# EAGLE design bt lokomotivy v1 (EAGLE 6.3)
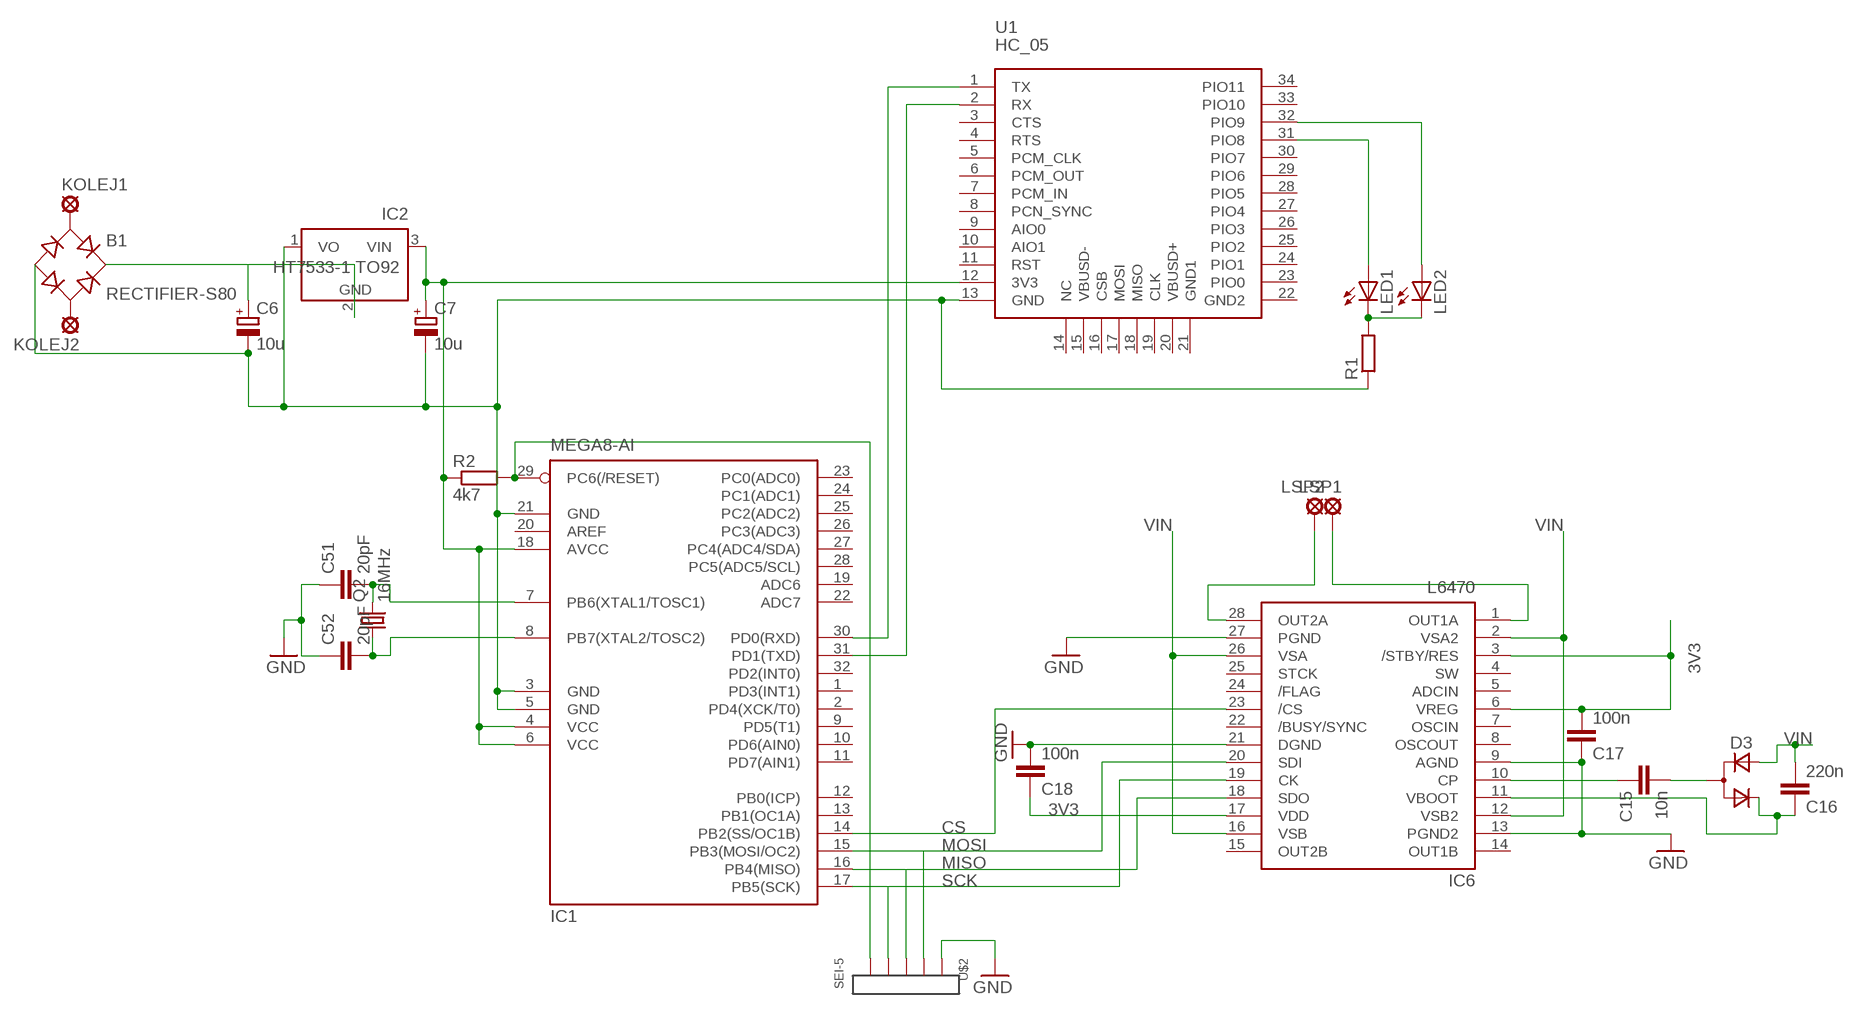
[diagram p0: schematic, sheet 1]

## Parts
B1  RECTIFIER-S80  [TO-269AA]
C6  10u  CPOL-EU153CLV-0405  [153CLV-0405]
C7  10u  CPOL-EU153CLV-0405  [153CLV-0405]
C15  10n  C-EUC0603  [C0603]
C16  220n  C-EUC0603K  [C0603K]
C17  100n  C-EUC0402  [C0402]
C18  100n  C-EUC0402  [C0402]
C51  20pF  C-EUC0603  [C0603]
C52  20pF  C-EUC0603  [C0603]
D3  D_ACACSOT323  [SOT323]
IC1  MEGA8-AI  [TQFP32-08]
IC2  HT7533-1 TO92  LM2936Z-3.0  [TO92]
IC6  L6470  [HTSSOP28]
KOLEJ1  LSP10  [LSP10]
KOLEJ2  LSP10  [LSP10]
LED1  LEDCHIPLED_0603  [CHIPLED_0603]
LED2  LEDCHIPLED_0603  [CHIPLED_0603]
LSP1  LSP10  [LSP10]
LSP2  LSP10  [LSP10]
Q2  16MHz  CRYSTALHC49UP  [HC49UP]
R1  R-EU_R0603  [R0603]
R2  4k7  R-EU_R0603  [R0603]
U1  HC_05  [BLUETOOTH_SMD]
U$2  SEI-5  [SEI-5]

## Nets
3V3: C7.+ C17.2 C18.1 IC1.4(VCC) IC1.6(VCC) IC1.18(AVCC) IC2.3(VIN) IC6.3(/STBY/RES) IC6.6(VREG) IC6.17(VDD) R2.1 U1.12(3V3)
CS: IC1.14(PB2(SS/OC1B)) IC6.23(/CS)
GND [Power]: B1.- C6.- C7.- C17.1 C18.2 C51.1 C52.1 IC1.3(GND) IC1.5(GND) IC1.21(GND) IC2.1(VO) IC6.9(AGND) IC6.13(PGND2) IC6.21(DGND) IC6.27(PGND) R1.1 U1.13(GND) U$2.P$1
MISO: IC1.16(PB4(MISO)) IC6.18(SDO) U$2.P$3
MOSI: IC1.15(PB3(MOSI/OC2)) IC6.20(SDI) U$2.P$2
N$1: IC1.30(PD0(RXD)) U1.1(TX)
N$2: LED1.C LED2.C R1.2
N$3: B1.AC1 KOLEJ1.MP
N$4: B1.AC2 KOLEJ2.MP
N$5: IC1.31(PD1(TXD)) U1.2(RX)
N$8: IC1.29(PC6(/RESET)) R2.2 U$2.P$5
N$9: C51.2 IC1.7(PB6(XTAL1/TOSC1)) Q2.2
N$10: C52.2 IC1.8(PB7(XTAL2/TOSC2)) Q2.1
N$12: LED1.A U1.31(PIO8)
N$14: LED2.A U1.32(PIO9)
N$28: C15.1 IC6.10(CP)
N$29: C15.2 D3.1(CA)
SCK: IC1.17(PB5(SCK)) IC6.19(CK) U$2.P$4
VBOOTX: C16.1 D3.2(C) IC6.11(VBOOT)
VIN: B1.+ C6.+ C16.2 D3.3(A) IC2.2(GND) IC6.2(VSA2) IC6.12(VSB2) IC6.16(VSB) IC6.26(VSA)
X1: IC6.1(OUT1A) LSP1.MP
X2: IC6.28(OUT2A) LSP2.MP
Unconnected: IC1.1(PD3(INT1)) IC1.2(PD4(XCK/T0)) IC1.9(PD5(T1)) IC1.10(PD6(AIN0)) IC1.11(PD7(AIN1)) IC1.12(PB0(ICP)) IC1.13(PB1(OC1A)) IC1.19(ADC6) IC1.20(AREF) IC1.22(ADC7) IC1.23(PC0(ADC0)) IC1.24(PC1(ADC1)) IC1.25(PC2(ADC2)) IC1.26(PC3(ADC3)) IC1.27(PC4(ADC4/SDA)) IC1.28(PC5(ADC5/SCL)) IC1.32(PD2(INT0)) IC6.4(SW) IC6.5(ADCIN) IC6.7(OSCIN) IC6.8(OSCOUT) IC6.14(OUT1B) IC6.15(OUT2B) IC6.22(/BUSY/SYNC) IC6.24(/FLAG) IC6.25(STCK) U1.3(CTS) U1.4(RTS) U1.5(PCM_CLK) U1.6(PCM_OUT) U1.7(PCM_IN) U1.8(PCN_SYNC) U1.9(AIO0) U1.10(AIO1) U1.11(RST) U1.14(NC) U1.15(VBUSD-) U1.16(CSB) U1.17(MOSI) U1.18(MISO) U1.19(CLK) U1.20(VBUSD+) U1.21(GND1) U1.22(GND2) U1.23(PIO0) U1.24(PIO1) U1.25(PIO2) U1.26(PIO3) U1.27(PIO4) U1.28(PIO5) U1.29(PIO6) U1.30(PIO7) U1.33(PIO10) U1.34(PIO11)

## Library data of the parts
B1 = rectifier:RECTIFIER-: Rectifier
C6 C7 = rcl:CPOL-EU: POLARIZED CAPACITOR, European symbol
C15-C18 = resistor:C-EU: CAPACITOR, European symbol
C51 C52 = rcl:C-EU: CAPACITOR, European symbol
D3 = zetex:D_ACAC: Dual DIODE; OC_FARNELL: unknown; OC_NEWARK: unknown
IC1 = atmel:MEGA8: MICROCONTROLLER 8 Kbytes FLASH, 1 kbytes SRAM, 512 bytes EEPROM, USART, 6-channel 10 bit ADC, 2-channel 8 bit ADC Pin compatible with Atmega48, ATMega88, ATMega168 Source: avr.lbr; MPN: ATMEGA8-16AU; OC_FARNELL: 9171371; OC_NEWARK: 73M8863
IC2 = national-semiconductor:LM2936?*: Ultra-Low Quiescent Current LDO Voltage Regulator Source: Data sheet <http://www.national.com/ds/LM/LM2936.pdf>; MF: NATIONAL SEMICONDUCTOR; MPN: LM2936Z-3.0/NOPB; OC_FARNELL: 1312709; OC_NEWARK: 41K4531
IC6 = reprap:L6470: Fully integrated microstepping motor driver with motion engine and SPI
KOLEJ1 KOLEJ2 LSP1 LSP2 = solpad:LSP10: SOLDER PAD drill 1.0 mm, distributor Buerklin, 12H555
LED1 LED2 = led:LED: LED OSRAM: - CHIPLED LG R971, LG N971, LY N971, LG Q971, LY Q971, LO R971, LY R971 LH N974, LH R974 LS Q976, LO Q976, LY Q976 LO Q996 - Hyper CHIPLED LW Q18S LB Q993, LB Q99A, LB R99A - SideLED LS A670, LO A670, LY A670, LG A670, LP A670 LB A673, LV A673, LT A673, LW A673 LH A674 LY A675 LS A676, LA A676, LO A676, LY A676, LW A676 LS A679, LY A679, LG A679 - Hyper Micro SIDELED® LS Y876, LA Y876, LO Y876, LY Y876 LT Y87S - SmartLED LW L88C, LW L88S LB L89C, LB L89S, LG L890 LS L89K, LO L89K, LY L89K LS L896, LA L896, LO L896, LY L896 - TOPLED LS T670, LO T670, LY T670, LG T670, LP T670 LSG T670, LSP T670, LSY T670, LOP T670, LYG T670 LG T671, LOG T671, LSG T671 LB T673, LV T673, LT T673, LW T673 LH T674 LS T676, LA T676, LO T676, LY T676, LB T676, LH T676, LSB T676, LW T676 LB T67C, LV T67C, LT T67C, LS T67K, LO T67K, LY T67K, LW E67C LS E67B, LA E67B, LO E67B, LY E67B, LB E67C, LV E67C, LT E67C LW T67C LS T679, LY T679, LG T679 LS T770, LO T770, LY T770, LG T770, LP T770 LB T773, LV T773, LT T773, LW T773 LH T774 LS E675, LA E675, LY E675, LS T675 LS T776, LA T776, LO T776, LY T776, LB T776 LHGB T686 LT T68C, LB T68C - Hyper Mini TOPLED® LB M676 - Mini TOPLED Santana® LG M470 LS M47K, LO M47K, LY M47K Source: http://www.osram.convergy.de LUXEON: - LUMILED® LXK2-PW12-R00, LXK2-PW12-S00, LXK2-PW14-U00, LXK2-PW14-V00 LXK2-PM12-R00, LXK2-PM12-S00, LXK2-PM14-U00 LXK2-PE12-Q00, LXK2-PE12-R00, LXK2-PE12-S00, LXK2-PE14-T00, LXK2-PE14-U00 LXK2-PB12-K00, LXK2-PB12-L00, LXK2-PB12-M00, LXK2-PB14-N00, LXK2-PB14-P00, LXK2-PB14-Q00 LXK2-PR12-L00, LXK2-PR12-M00, LXK2-PR14-Q00, LXK2-PR14-R00 LXK2-PD12-Q00, LXK2-PD12-R00, LXK2-PD12-S00 LXK2-PH12-R00, LXK2-PH12-S00 LXK2-PL12-P00, LXK2-PL12-Q00, LXK2-PL12-R00 Source: www.luxeon.com KINGBRIGHT: KA-3528ASYC Source: www.kingbright.com
Q2 = crystal:CRYSTAL: CRYSTAL; OC_FARNELL: unknown; OC_NEWARK: unknown
R1 R2 = rcl:R-EU_: RESISTOR, European symbol
U1 = SerialPortBluetooth:HC_05
U$2 = con-samtec:SEI-5

## Net classes
0 default: width 0.15 mm, clearance 0.15 mm
1 Power: width 0.25 mm, drill 0.381 mm, clearance 0.15 mm

## Board
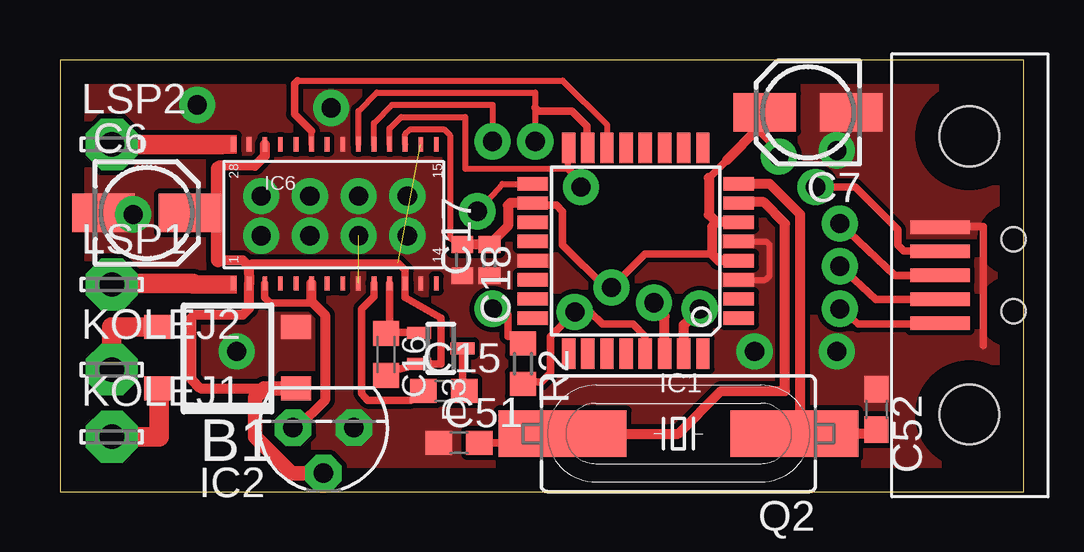
[diagram p1: board, top side]
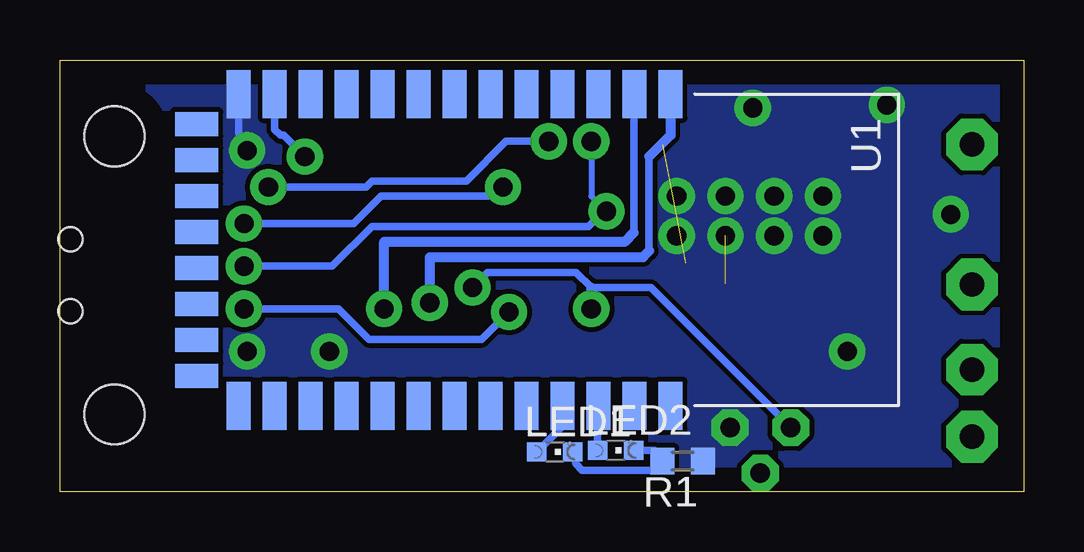
[diagram p2: board, bottom side, seen from below]

Size 40.18 x 18 mm. Coordinates in mm from the lower left corner, seen from the top.
Outline: 0,0 40.18,0 40.18,18 0,18 0,0
Copper layers (1*16): Top 0.035mm / dielectric 1.5mm / Bottom 0.035mm
Design rules "default *": minimum track width 10mil, minimum drill 24mil, track to track 8mil, track to pad 8mil, pad to pad 8mil, via to via 8mil, smd to smd 8mil, copper to edge 1mm, drill to drill 8mil, minimum pad ring 14mil, minimum via ring 14mil, stop-mask expansion 4mil, vias tented up to drill 0mil, thermal gap 10mil

### Footprints (pad centres in the part's own frame; a part is rotated, then mirrored left to right if it is on the bottom)
TO-269AA = smd 1 x 1.25: + -1.28,-2.855; - 1.28,-2.855; AC1 -1.28,2.855; AC2 1.28,2.855
153CLV-0405 = smd 2.6 x 1.6: + 1.8,0; - -1.8,0
C0603 = smd 1.1 x 1: 1 -0.85,0; 2 0.85,0
C0603K = smd 1.05 x 1.08: 1 -0.875,0; 2 0.875,0
C0402 = smd 0.7 x 0.9: 1 -0.65,0; 2 0.65,0
SOT323 = smd 0.5 x 1: 1 0,0.9; 2 -0.65,-0.9; 3 0.65,-0.9
TQFP32-08 = smd 1.27 x 0.559: 1 -4.293,2.8; 2 -4.293,2; 3 -4.293,1.2; 4 -4.293,0.4; 5 -4.293,-0.4; 6 -4.293,-1.2; 7 -4.293,-2; 8 -4.293,-2.8; 17 4.293,-2.8; 18 4.293,-2; 19 4.293,-1.2; 20 4.293,-0.4; 21 4.293,0.4; 22 4.293,1.2; 23 4.293,2; 24 4.293,2.8 | smd 0.559 x 1.27: 9 -2.8,-4.293; 10 -2,-4.293; 11 -1.2,-4.293; 12 -0.4,-4.293; 13 0.4,-4.293; 14 1.2,-4.293; 15 2,-4.293; 16 2.8,-4.293; 25 2.8,4.293; 26 2,4.293; 27 1.2,4.293; 28 0.4,4.293; 29 -0.4,4.293; 30 -1.2,4.293; 31 -2,4.293; 32 -2.8,4.293
TO92 = drill 0.813 pad 1.27 octagon: 1 -1.27,0; 2 0,1.905; 3 1.27,0
HTSSOP28 = smd 0.2 x 0.6: 1 -4.445,-3.26; 2 -3.795,-3.26; 3 -3.145,-3.26; 4 -2.495,-3.26; 5 -1.845,-3.26; 6 -1.195,-3.26; 7 -0.545,-3.26; 8 0.105,-3.26; 9 0.755,-3.26; 10 1.405,-3.26; 11 2.055,-3.26; 12 2.705,-3.26; 13 3.355,-3.26; 14 4.005,-3.26; 15 4.005,2.54; 16 3.355,2.54; 17 2.705,2.54; 18 2.055,2.54; 19 1.405,2.54; 20 0.755,2.54; 21 0.105,2.54; 22 -0.545,2.54; 23 -1.195,2.54; 24 -1.845,2.54; 25 -2.495,2.54; 26 -3.145,2.54; 27 -3.795,2.54; 28 -4.445,2.54
LSP10 = drill 1.016 pad 2.159 octagon: MP 0,0
CHIPLED_0603 = smd 0.8 x 0.8: A 0,-0.75; C 0,0.75
HC49UP = smd 5.334 x 1.93: 1 -4.826,0; 2 4.826,0
R0603 = smd 1 x 1.1: 1 -0.85,0; 2 0.85,0
BLUETOOTH_SMD = smd 2 x 1: 1 0,0; 2 0,-1.5; 3 0,-3; 4 0,-4.5; 5 0,-6; 6 0,-7.5; 7 0,-9; 8 0,-10.5; 9 0,-12; 10 0,-13.5; 11 0,-15; 12 0,-16.5; 13 0,-18; 22 13,-18; 23 13,-16.5; 24 13,-15; 25 13,-13.5; 26 13,-12; 27 13,-10.5; 28 13,-9; 29 13,-7.5; 30 13,-6; 31 13,-4.5; 32 13,-3; 33 13,-1.5; 34 13,0 | smd 1 x 1.8: 14 1.25,-19.75; 15 2.75,-19.75; 16 4.25,-19.75; 17 5.75,-19.75; 18 7.25,-19.75; 19 8.75,-19.75; 20 10.25,-19.75; 21 11.75,-19.75
SEI-5 = smd 0.56 x 2.477: P$1 -2,-1.04; P$2 -1,-1.04; P$3 0,-1.04; P$4 1,-1.04; P$5 2,-1.04 | hole 2.5: -5.8,0.187; 5.8,0.187 | hole 1: -1.5,2.03; 1.5,2.03

### Placement (x,y rotation side)
B1  6.99,5.59 90 top
C6  3.62,11.62 0 top
C7  31.18,15.81 180 top
C15  16,4.19 0 top
C16  13.59,5.71 270 top
C17  17.91,9.65 90 top
C18  16.76,9.65 270 top
C51  16.64,2.03 0 top
C52  34.04,3.43 270 top
D3  15.88,5.97 270 top
IC1  24,10.03 180 top
IC2  10.99,2.67 180 top
IC6  11.68,11.94 0 top
KOLEJ1  2.16,2.29 0 top
KOLEJ2  2.16,5.08 0 top
LED1  19.56,1.65 270 bottom
LED2  17.02,1.71 270 bottom
LSP1  2.16,8.64 0 top
LSP2  2.16,14.48 0 top
Q2  25.78,2.41 180 top
R1  14.22,1.27 180 bottom
R2  19.3,5.33 270 top
U1  14.73,16.57 270 bottom
U$2  37.72,9.02 270 top

### Tracks (layer width: path | path; a pad name or v marks a point on that pad's centre or on a via)
3V3  (via drill 0.8)
  Top 0.254: IC6.17 14.39,14.9 14.61,15.11 16,15.11 16.26,14.86 16.26,10.56 C18.1
  Top 0.305: IC6.3 8.54,8.1 8.76,7.87 10.44,7.87 10.49,7.93 | 27.81,13.84 27.05,13.08 | 27.18,9.91 24.38,9.91 v22.99,8.51 22.73,8.51 20.95,10.29 20.95,11.68 20.7,11.94 19.8,11.94 IC1.18 | C7.+ 29.4,15.81 29.46,15.75 | v29.97,13.97 29.97,14.22 29.08,15.11 | v18.03,7.62 18.67,7.37 18.67,6.48 19.01,6.48 R2.1
  Top 0.406: IC6.6 10.49,7.93 11.05,7.37 11.05,3.81 9.91,2.67 IC2.3 | IC1.18 18.76,12.03 18.67,11.94 18.67,11.06 C17.2 C18.1 | IC1.4 27.45,9.63 27.18,9.91 27.18,11.05 27.36,11.23 | IC1.6 27.36,11.23 | C7.+ 29.38,15.41 29.08,15.11 27.81,13.84 | 27.05,13.08 27.05,11.54 27.36,11.23
  Top 0.61: IC2.3 10.16,2.67
  Bottom 0.305: IC2.3 15.56,8.51 18.03,8.51 18.67,9.14 22.35,9.14 v22.99,8.51 | U1.12 31.23,15.1 30.99,14.86 30.86,14.86 v29.97,13.97
  Bottom 0.406: v18.03,7.62 18.03,8.51
CS
  Top 0.254: IC6.23 10.49,15.04 | 9.91,17.14 20.95,17.14 22.8,15.3 IC1.14
  Top 0.305: 9.91,17.14 9.78,17.02 9.78,15.75 10.49,15.04
GND  (via drill 0.8)  (1 unrouted)
  Top 0.254: IC1.3 29.41,8.83 29.59,9.02 29.59,10.29 29.46,10.41 28.32,10.41 IC1.5
  Top 0.305: 37.85,11.05 38.48,11.05 38.48,6.1 | v32.38,14.22 32.38,15.22 C7.-
  Bottom 0.305: U1.13 32.73,14.95 v32.38,14.22
  other vias: 7.37,5.84 8.38,12.32 8.38,10.67 10.41,10.67 10.41,12.32 12.45,12.32 12.45,10.67 14.48,10.67 14.48,12.32 5.71,16.13 11.3,16 3.05,11.56 28.96,5.84 32.38,5.84
  pour Top (no thermals): 0,18.03 41.02,18.16 41.02,0.13 0,0
  pour Bottom (no thermals): 0,0 0,18.03 41.02,18.16 41.02,0.13
MISO  (via drill 0.8)
  Top 0.254: IC6.18 13.74,15.14 14.22,15.62 16.89,15.62 16.89,13.46 21.18,13.46 IC1.16
  Top 0.305: v21.72,12.7 21.72,12.92 21.18,13.46 | U$2.P$3 34.8,9.02 v32.51,11.18
  Bottom 0.305: v32.51,11.18 27.94,11.18 26.8,12.32 21.97,12.32 v21.72,12.7
MOSI  (via drill 0.8)
  Top 0.254: IC6.20 12.44,15.87 13.21,16.64 19.81,16.64 19.81,16 v19.81,14.61 | 21.97,14.36 IC1.15 | 36.66,10.03 U$2.P$2
  Top 0.305: 21.97,14.36 21.97,15.24 21.34,15.88 19.94,15.88 19.81,16 | 36.66,10.03 35.18,10.03 34.92,10.29 34.92,10.92 33.15,12.7 v31.5,12.7
  Bottom 0.305: v31.5,12.7 27.43,12.7 27.18,12.95 23.24,12.95 21.59,14.61 v19.81,14.61
N$1  (via drill 0.8)
  Top 0.406: IC1.30 25.2,7.31 v24.77,7.87
  Bottom 0.305: 15.62,13.97 15.62,10.03
  Bottom 0.406: v24.77,7.87 24.77,9.78 15.88,9.78 15.62,10.03 | U1.1 14.73,14.86 15.62,13.97
N$2
  Bottom 0.305: LED1.C 18.68,1.16 18.41,0.89 15.33,0.89 R1.2 15.39,1.71 LED2.C
N$3
  Top 0.813: B1.AC1 4.13,2.29 KOLEJ1.MP
N$4
  Top 0.813: B1.AC2 2.16,6.87 KOLEJ2.MP
N$5  (via drill 0.8)
  Top 0.406: IC1.31 26,6.95 v26.67,7.62
  Bottom 0.305: 16.26,16.55 16.26,10.79
  Bottom 0.406: v26.67,7.62 26.67,10.41 16.64,10.41 16.26,10.79 | 16.26,16.55 U1.2
N$8  (via drill 0.8)
  Top 0.305: U$2.P$5 36.65,6.99 33.27,6.99 v32.51,7.62 | IC1.29 24.38,5.76 24.38,6.48 23.88,6.99 22.61,6.99 22.1,7.49 v21.46,7.49 20.45,6.48 20.45,4.95 20.07,4.57 19.39,4.57 R2.2
  Bottom 0.305: v32.51,7.62 28.57,7.62 27.3,6.35 22.61,6.35 v21.46,7.49
N$9
  Top 0.305: C51.2 20.57,2.03 Q2.2
  Top 0.406: Q2.2 25.78,2.41 27.56,4.19 30.23,4.19 30.23,11.18 29.34,12.06 28.33,12.06 IC1.7
N$10
  Top 0.406: Q2.1 31.11,2.41 30.86,2.67 | 30.86,2.67 30.86,11.56 29.59,12.83 IC1.8 | C52.2 33.91,2.41 31.24,2.41 30.86,2.67
N$12
  Bottom 0.305: U1.31 19.23,2.73 LED1.A
N$14
  Bottom 0.305: U1.32 17.77,3.23 LED2.A
N$28
  Top 0.305: IC6.10 13.09,8.14 12.57,7.62 12.57,4.1 12.83,3.81 14.64,3.81 C15.1
N$29
  Top 0.305: D3.1 16.77,4.5 C15.2
SCK  (via drill 0.8)
  Top 0.254: IC6.19 13.09,15.38 13.84,16.13 18.03,16.13 v18.03,14.61 | IC1.17 18.45,12.83 v17.4,11.68
  Top 0.305: U$2.P$4 34.02,8.02 v32.51,9.4
  Bottom 0.254: v18.03,14.61 18.03,12.32 v17.4,11.68
  Bottom 0.305: v32.51,9.4 28.83,9.4 27.18,11.05 18.16,11.05 17.53,11.68 v17.4,11.68
VBOOTX
  Top 0.305: IC6.11 13.74,6.83 | D3.2 14.99,6.63 13.5,6.63 C16.1
  Top 0.406: 13.74,6.83 13.74,6.74 C16.1
VIN  (1 unrouted)
  Top 0.305: 7.87,9.4 8,9.53 14.1,9.53 14.39,9.23 IC6.12 14.39,8.09 15.88,7.24 15.88,5.33 D3.3 13.61,4.97 C16.2 | C6.+ 6.54,11.62 6.6,11.56
  Top 0.406: IC6.26 8.54,14 8.13,13.59 6.6,13.59 6.6,13.46 | 6.6,9.65 7.62,9.65 7.87,9.4 IC6.2 7.87,8.66 7.87,7.62 7.62,7.37 5.59,7.37 5.46,7.24 5.46,4.7 5.85,4.31 8.51,4.31
  Top 0.61: 6.6,13.46 6.6,11.56 6.6,9.65 | IC2.2 9.65,0.76 8.13,2.29 8.13,3.93 8.51,4.31 B1.+
X1
  Top 0.254: 5.55,8.68 IC6.1
  Top 0.813: 5.55,8.68 2.24,8.68 LSP1.MP
X2
  Top 0.254: 6.73,14.48 IC6.28
  Top 0.813: 6.73,14.48 LSP2.MP
(copper drawn outside any net)
  shapes: Top area x2